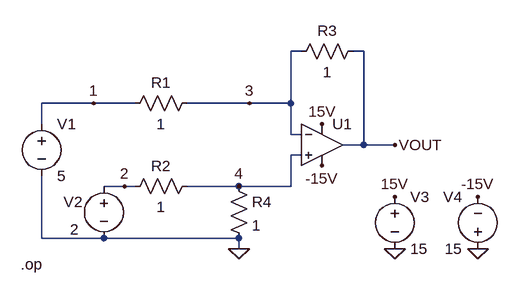
[diagram p0: schematic test_circuit_4.asc]
test_circuit_4.asc, the LTspice schematic file:
Version 4
SHEET 1 880 680
WIRE 320 32 304 32
WIRE 416 32 400 32
WIRE 0 112 -80 112
WIRE 64 112 0 112
WIRE 240 112 144 112
WIRE 304 112 304 32
WIRE 304 112 240 112
WIRE -80 144 -80 112
WIRE 304 160 304 112
WIRE 320 160 304 160
WIRE 416 176 416 32
WIRE 416 176 384 176
WIRE 464 176 416 176
WIRE 320 192 304 192
WIRE 48 240 16 240
WIRE 64 240 48 240
WIRE 224 240 144 240
WIRE 304 240 304 192
WIRE 304 240 224 240
WIRE -80 320 -80 224
WIRE 16 320 -80 320
WIRE 224 320 16 320
WIRE 224 336 224 320
FLAG 352 144 15V
FLAG 352 208 -15V
FLAG 464 176 VOUT
FLAG 224 336 0
FLAG 464 256 15V
FLAG 464 336 0
FLAG 592 336 0
FLAG 592 256 -15V
FLAG 0 112 1
FLAG 240 112 3
FLAG 48 240 2
FLAG 224 240 4
SYMBOL res 160 96 R90
WINDOW 0 0 56 VBottom 2
WINDOW 3 32 56 VTop 2
SYMATTR InstName R1
SYMATTR Value 1
SYMBOL res 160 224 R90
WINDOW 0 0 56 VBottom 2
WINDOW 3 32 56 VTop 2
SYMATTR InstName R2
SYMATTR Value 1
SYMBOL res 416 16 R90
WINDOW 0 0 56 VBottom 2
WINDOW 3 32 56 VTop 2
SYMATTR InstName R3
SYMATTR Value 1
SYMBOL res 208 224 R0
SYMATTR InstName R4
SYMATTR Value 1
SYMBOL OpAmps\\UniversalOpAmp 352 176 R0
SYMATTR InstName U1
SYMBOL voltage -80 128 R0
WINDOW 123 0 0 Left 0
WINDOW 39 0 0 Left 0
SYMATTR InstName V1
SYMATTR Value 5
SYMBOL voltage 16 224 R0
WINDOW 0 -62 40 Left 2
WINDOW 3 -52 82 Left 2
WINDOW 123 0 0 Left 0
WINDOW 39 0 0 Left 0
SYMATTR InstName V2
SYMATTR Value 2
SYMBOL voltage 464 240 R0
WINDOW 123 0 0 Left 0
WINDOW 39 0 0 Left 0
SYMATTR InstName V3
SYMATTR Value 15
SYMBOL voltage 592 352 R180
WINDOW 0 24 96 Left 2
WINDOW 3 24 16 Left 2
WINDOW 123 0 0 Left 0
WINDOW 39 0 0 Left 0
SYMATTR InstName V4
SYMATTR Value 15
TEXT -112 360 Left 2 !.op

The netlist it stands for:
* test_circuit_4.asc
R1 3 1 1
R2 4 2 1
R3 VOUT 3 1
R4 4 0 1
XU1 4 3 15V -15V VOUT level1 Avol=1Meg GBW=10Meg Vos=0 En=0 Enk=0 In=0 Ink=0 Rin=500Meg  ; pins In+ In- V+ V- OUT
V1 1 0 5
V2 2 0 2
V3 15V 0 15
V4 0 -15V 15
.op
.lib UniversalOpAmp1.lib
.backanno
.end